# EasyEDA Pro project A类功放.eprj

# Schematic Schematic1
Board Name: Board1; Create Date: 2025-03-25; Page Name: P1; Project Name: A类功放; Schematic Name: Schematic1; Update Date: 2025-03-25; Company: 嘉立创EDA; Page Size: A4; Version: V1.0
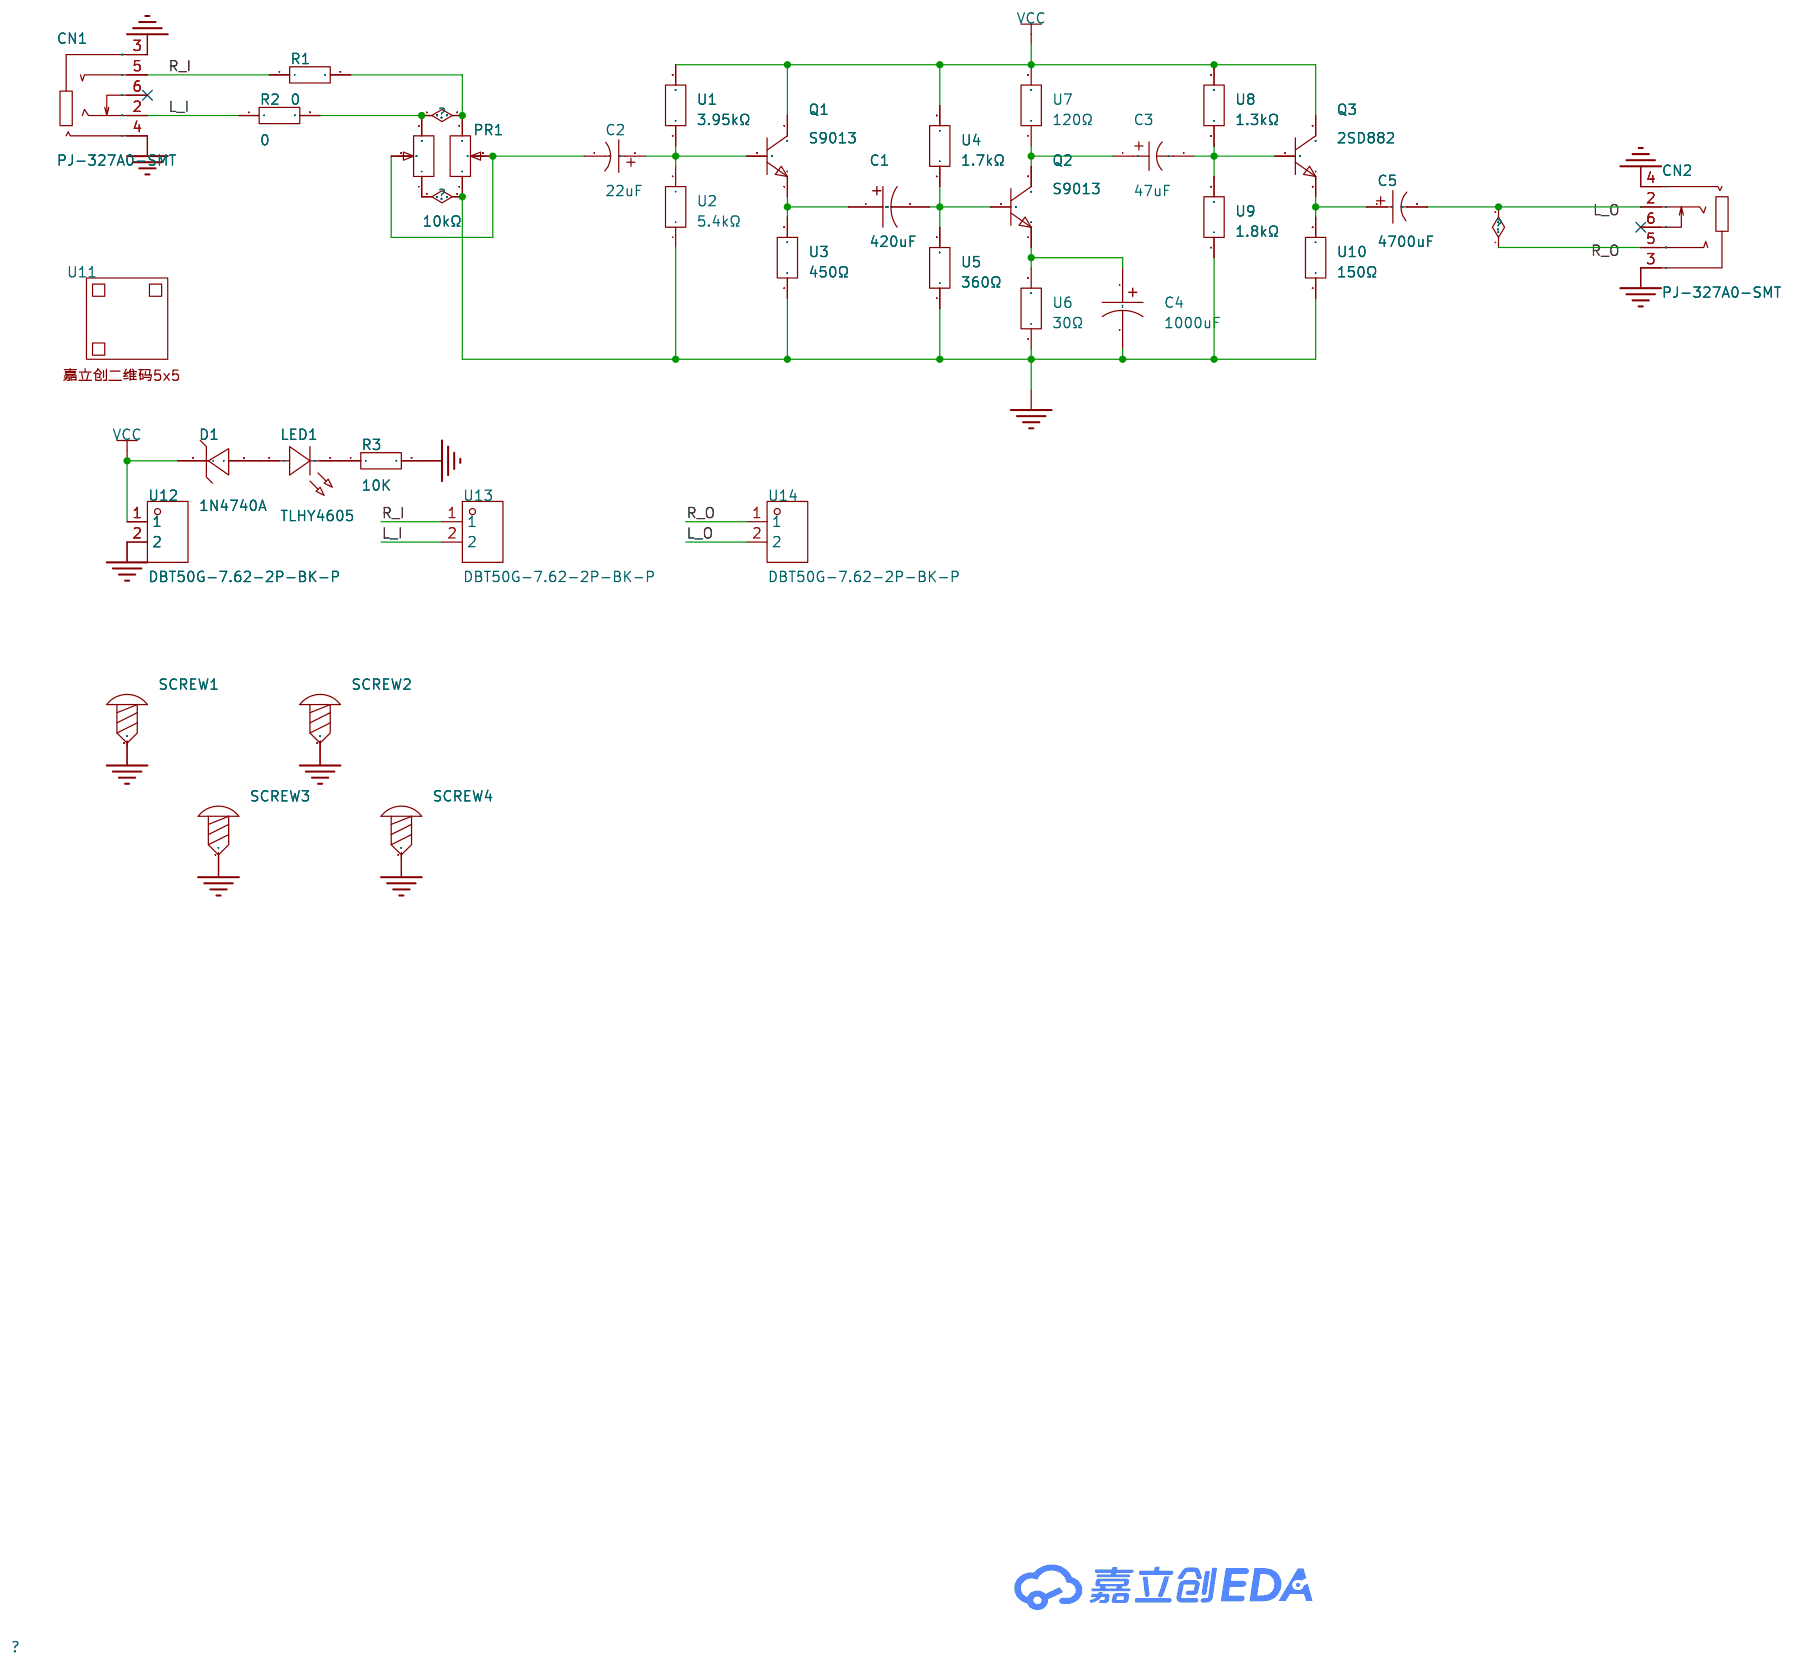
[diagram p0: schematic sheet]

## Parts
C1  420uF  [CAP-TH_BD8.0-P3.50-D0.6-FD]
C2  22uF  [CAP-TH_BD5.0-P2.00-D0.8-FD]
C3  47uF  [CAP-TH_BD5.0-P2.00-D0.8-FD]
C4  1000uF  [CAP-TH_BD10.0-P5.00-D1.0-FD]
C5  4700uF  [CAP-TH_BD16.0-P7.50-D1.2-FD]
CN1  PJ-327A0-SMT  [AUDIO-SMD_PJ-327A0-SMT]
CN2  PJ-327A0-SMT  [AUDIO-SMD_PJ-327A0-SMT]
D1  1N4740A  [DO-41_BD2.4-L4.7-P8.70-D0.9-RD]
LED1  TLHY4605  [LED-TH_BD3.2-P2.54-RD]
PR1  10kΩ  [RES-ADJ-TH_RK16312A0BKR]
Q1  S9013  [TO-92-3_L4.5-W3.5-P1.27-L]
Q2  S9013  [TO-92-3_L4.5-W3.5-P1.27-L]
Q3  2SD882  [TO-126_L8.3-W3.5-P2.29-T]
R1  0  [R0805]
R2  0  [R0805]
R3  10K  [R0805]
SCREW1  -  [M3螺丝]
SCREW2  -  [M3螺丝]
SCREW3  -  [M3螺丝]
SCREW4  -  [M3螺丝]
U1  3.95kΩ  [RES-TH_BD2.7-L6.2-P10.20-D0.4]
U2  5.4kΩ  [RES-TH_BD2.7-L6.2-P10.20-D0.4]
U3  450Ω  [RES-TH_BD2.7-L6.2-P10.20-D0.4]
U4  1.7kΩ  [RES-TH_BD2.7-L6.2-P10.20-D0.4]
U5  360Ω  [RES-TH_BD2.7-L6.2-P10.20-D0.4]
U6  30Ω  [RES-TH_BD2.7-L6.2-P10.20-D0.4]
U7  120Ω  [RES-TH_BD2.7-L6.2-P10.20-D0.4]
U8  1.3kΩ  [RES-TH_BD2.7-L6.2-P10.20-D0.4]
U9  1.8kΩ  [RES-TH_BD2.7-L6.2-P10.20-D0.4]
U10  150Ω  [RES-TH_BD2.7-L6.2-P10.20-D0.4]
U11  -  [JLC-QRCODE-5x5]
U12  DBT50G-7.62-2P-BK-P  [CONN-TH_2P-P7.62_L15.2-W16.7-EX4.2]
U13  DBT50G-7.62-2P-BK-P  [CONN-TH_2P-P7.62_L15.2-W16.7-EX4.2]
U14  DBT50G-7.62-2P-BK-P  [CONN-TH_2P-P7.62_L15.2-W16.7-EX4.2]

## Library data of the parts
C1 = 10YXG420MEFCTA8X7.5: LCSC Part Name: 420uF ±20% 10V; Supplier Part: C1592947; Manufacturer: rubycon(红宝石); Supplier Footprint: 插件,D8xL7.5mm; JLCPCB Part Class: Extended Part; Datasheet: https://atta.szlcsc.com/upload/public/pdf/source/20220328/A59CDC04CA3C2D674CA1281D38C243D4.pdf; Supplier: LCSC; Tolerance: ±20%; Rated Voltage: 10V; φD: 8mm; L: 7.5mm; Operating Temperature: -40℃~+105℃
C2 = EWH1HM220D11OT: LCSC Part Name: 22uF ±20% 50V; Supplier Part: C105323; Manufacturer: AISHI(艾华集团); Supplier Footprint: 插件,D5xL11mm; JLCPCB Part Class: Extended Part; Datasheet: https://atta.szlcsc.com/upload/public/pdf/source/20200106/C481308_16D735F9103482ADD8491C667D201AFA.pdf; Supplier: LCSC; Tolerance: ±20%; Voltage Rating: 50V; Ripple Current: 65mA@120Hz; Pin Spacing: 2mm; Diameter: 5mm; Height - Seated (Max): 11mm; Lifetime: 2000hrs@105℃
C3 = ERS1EM470D11OT: LCSC Part Name: 47uF ±20% 25V; Supplier Part: C106650; Manufacturer: AISHI(艾华集团); Supplier Footprint: 插件,D5xL11mm; JLCPCB Part Class: Extended Part; Datasheet: https://atta.szlcsc.com/upload/public/pdf/source/20191015/C438940_4B8E60A742BB0AE40DDEF87A5C89089D.pdf; Supplier: LCSC; Tolerance: ±20%; Voltage Rating: 25V; Pin Spacing: 2mm; Diameter: 5mm; Height - Seated (Max): 11mm; Lifetime: 5000hrs@105℃
C4 = 01EC4294SHC1000UF25V: LCSC Part Name: 1000uF ±20% 25V; Supplier Part: C503217; Manufacturer: KNSCHA(科尼盛); Supplier Footprint: 插件,D10xL16mm; JLCPCB Part Class: Extended Part; Datasheet: https://atta.szlcsc.com/upload/public/pdf/source/20240806/1082112373C74E03ED6704D18D61A53D.pdf; Supplier: LCSC; Tolerance: ±20%; Rated Voltage: 25V; Ripple Current: 450mA@120Hz; Lead Spacing: 5mm; φD: 10mm; L: 16mm; Lifetime @ Temp: 5000hrs@105℃
C5 = KM478M025K25RR0VH2FP0: LCSC Part Name: 4700uF ±20% 25V; Supplier Part: C45070; Manufacturer: CX(承兴); Supplier Footprint: 插件,D16xL25mm; JLCPCB Part Class: Extended Part; Datasheet: https://atta.szlcsc.com/upload/public/pdf/source/20211027/06D6BA3719C264B639DC286D935D03EA.pdf; Supplier: LCSC; Tolerance: ±20%; Rated Voltage: 25V; Lead Spacing: 7.5mm; φD: 16mm; L: 25mm; Lifetime @ Temp: 2000hrs@105℃
CN1 CN2 = PJ-327A0-SMT: 连接器类型:3.5mm耳机座;额定电流:500mA;额定电压:30V;工作温度范围:-20℃~+70℃;焊接温度(最大值):235℃;; LCSC Part Name: 3.5mm耳机座; Supplier Part: C381135; Manufacturer: XKB Connectivity(中国星坤); Supplier Footprint: SMD; JLCPCB Part Class: 扩展库; Datasheet: https://atta.szlcsc.com/upload/public/pdf/source/20211011/16B83D74DCFBFB52BBA1016D248FDA16.pdf; Supplier: LCSC; Connector Type: 3.5mm耳机座; Current Rating (Max): 500mA; Voltage Rating (Max): 30V; Operating Temperature Range: -20℃~+70℃; Soldering Temperature(Max): 235℃
D1 = 1N4740A_C238926: Supplier Part: C238926; Manufacturer: onsemi(安森美); Supplier Footprint: 插件,D2.03xL4.06mm; JLCPCB Part Class: Extended Part; Datasheet: https://atta.szlcsc.com/upload/public/pdf/source/20181009/C258175_DA035AFC58BF64FEA7E7C840A4D35D50.pdf; Supplier: LCSC; Diode Configuration: 独立式; Zener Voltage (Nom): 10V; Reverse Leakage Current (Ir): 10uA@7.6V; Zener Voltage (Range): 9.5V~10.5V; Power Dissipation: 1W; Zener Impedance (Zzt): 7Ω; Tolerance: ±5%
LED1 = TLHY4605: Supplier Part: C5960857; Manufacturer: VISHAY(威世); Supplier Footprint: 插件; JLCPCB Part Class: Extended Part; Datasheet: https://atta.szlcsc.com/upload/public/pdf/source/20230606/BB01526525C990542ED51A367FB43B85.pdf; Supplier: LCSC; Illumination Color: 黄色; Voltage - Forward(Vf): 2.4V; Forward Current: 10mA; Wavelength - Dominant: 588nm; Peak Wavelength: 585nm; Luminous Intensity: 5mcd; Viewing Angle: 120°
PR1 = RK16312101A2: LCSC Part Name: 10kΩ ±20% 三件套; Supplier Part: C470593; Manufacturer: ALPSALPINE(阿尔卑斯阿尔派); Supplier Footprint: 插件-6P; JLCPCB Part Class: Extended Part; Datasheet: https://atta.szlcsc.com/upload/public/pdf/source/20191216/C470593_7E935C2EB9A734DEAF0A292D32EDD773.pdf; Supplier: LCSC; Tolerance: ±20%; Turns: 1
Q1 Q2 = S9013_C2931497: Supplier Part: C2931497; Manufacturer: JSMSEMI(杰盛微); Supplier Footprint: TO-92-3; JLCPCB Part Class: Extended Part; Datasheet: https://atta.szlcsc.com/upload/public/pdf/source/20240105/5BA87CBB10CD2800A606235A557ECDD5.pdf; Supplier: LCSC; type: NPN; Current - Collector(Ic): 500mA; Collector - Emitter Voltage VCEO: 25V; Pd - Power Dissipation: 625mW; DC Current Gain: 144@50mA,1V; Transition frequency(fT): 150MHz; Current - Collector Cutoff: 100nA; Vce Saturation(VCE(sat)): 600mV
Q3 = 2SD882_C90797: LCSC Part Name: NPN 电流:3A 耐压:30V; Supplier Part: C90797; Manufacturer: ST(意法半导体); Supplier Footprint: TO-126; JLCPCB Part Class: Extended Part; Datasheet: https://atta.szlcsc.com/upload/public/pdf/source/20161226/1482720159312.pdf; Supplier: LCSC; Transistor Type: NPN; Collector Current (Ic): 3A; Collector-Emitter Breakdown Voltage (Vceo): 30V; Power Dissipation (Pd): 12.5W; DC Current Gain (hFE@Ic,Vce): 100@1A,2V; Transition Frequency (fT): 100MHz; Collector Cut-Off Current (Icbo): 100uA; Collector-Emitter Saturation Voltage (VCE(sat)@Ic,Ib): 400mV@1A,50mA; Operating Temperature: -65℃~+150℃
R1-R3 = Res_0805: Supplier Footprint: 0805
SCREW1-SCREW4 = M3螺丝: Supplier Footprint: 插件
U1-U10 = MF1/4W-3Ω9±1%-ST52: LCSC Part Name: 金属膜电阻 3.9Ω ±1% 250mW; Supplier Part: C2848601; Manufacturer: VO(翔胜); Supplier Footprint: 插件,D2.7xL6.2mm; JLCPCB Part Class: Extended Part; Datasheet: https://atta.szlcsc.com/upload/public/pdf/source/20200609/C601728_5AA4C0C8E12E11069DA2C3356F29D1F2.pdf; Supplier: LCSC; Type: 金属膜电阻; Tolerance: ±1%; Overload Voltage (Max): 250V; Power(Watts): 250mW; Temperature Coefficient: ±400ppm/℃; Operating Temperature Range: -55℃~+155℃
U11 = 嘉立创二维码5x5
U12-U14 = DBT50G-7.62-2P-BK-P: LCSC Part Name: 7.62mm 1x2P 每排P数:2 排数:1 直针 边脚; Supplier Part: C496127; Manufacturer: DORABO(地博电气); Supplier Footprint: 插件,P=7.62mm; JLCPCB Part Class: Extended Part; Datasheet: https://atta.szlcsc.com/upload/public/pdf/source/20230321/5EF6A0D07A73B1490602C5D26A4C0507.pdf; Supplier: LCSC; Barrier Type: 带盖板; Pitch: 7.62mm; Structure: 1x2P; Mounting Style: 直针; Pin Location: 边脚; Number of Pins: 2P; Number of Rows: 1; Current Rating (Max): 20A; Voltage Rating (Max): 300V; Wire Gauge - AWG: 12~22; Operating Temperature Range: -40℃~+105℃; Color: 黑色; Number of PINs Per Row: 2

## Nets
GND: C4.2 CN1.3 CN1.4 CN2.3 CN2.4 PR1.1 PR1.4 R3.2 SCREW1.1 SCREW2.1 SCREW3.1 SCREW4.1 U2.1 U3.1 U5.1 U6.1 U9.1 U10.1 U12.2
VCC: D1.1(K) Q1.3(C) Q3.2(C) U1.2 U4.2 U7.2 U8.2 U12.1
L_I: CN1.2 R2.1 U13.2
L_O: C5.2 CN2.2 CN2.5 U14.1 U14.2
R_I: CN1.5 R1.1 U13.1
$1N174: C2.1 Q1.2(B) U1.1 U2.2
$1N304: C1.1 Q1.1(E) U3.2
$1N442: C1.2 Q2.2(B) U4.1 U5.2
$1N655: C3.1 Q2.3(C) U7.1
$1N660: C4.1 Q2.1(E) U6.2
$1N1030: C3.2 Q3.1(B) U8.1 U9.2
$1N1165: C5.1 Q3.3(E) U10.2
$1N2103: C2.2 PR1.2 PR1.5
$1N2212: PR1.3 PR1.6 R1.2 R2.2
$1N3020: D1.2(A) LED1.2(A)
$1N3022: LED1.1(C) R3.1

Not connected (* = marked no-connect by the designer): CN1 6*; CN2 6*

# Board PCB1
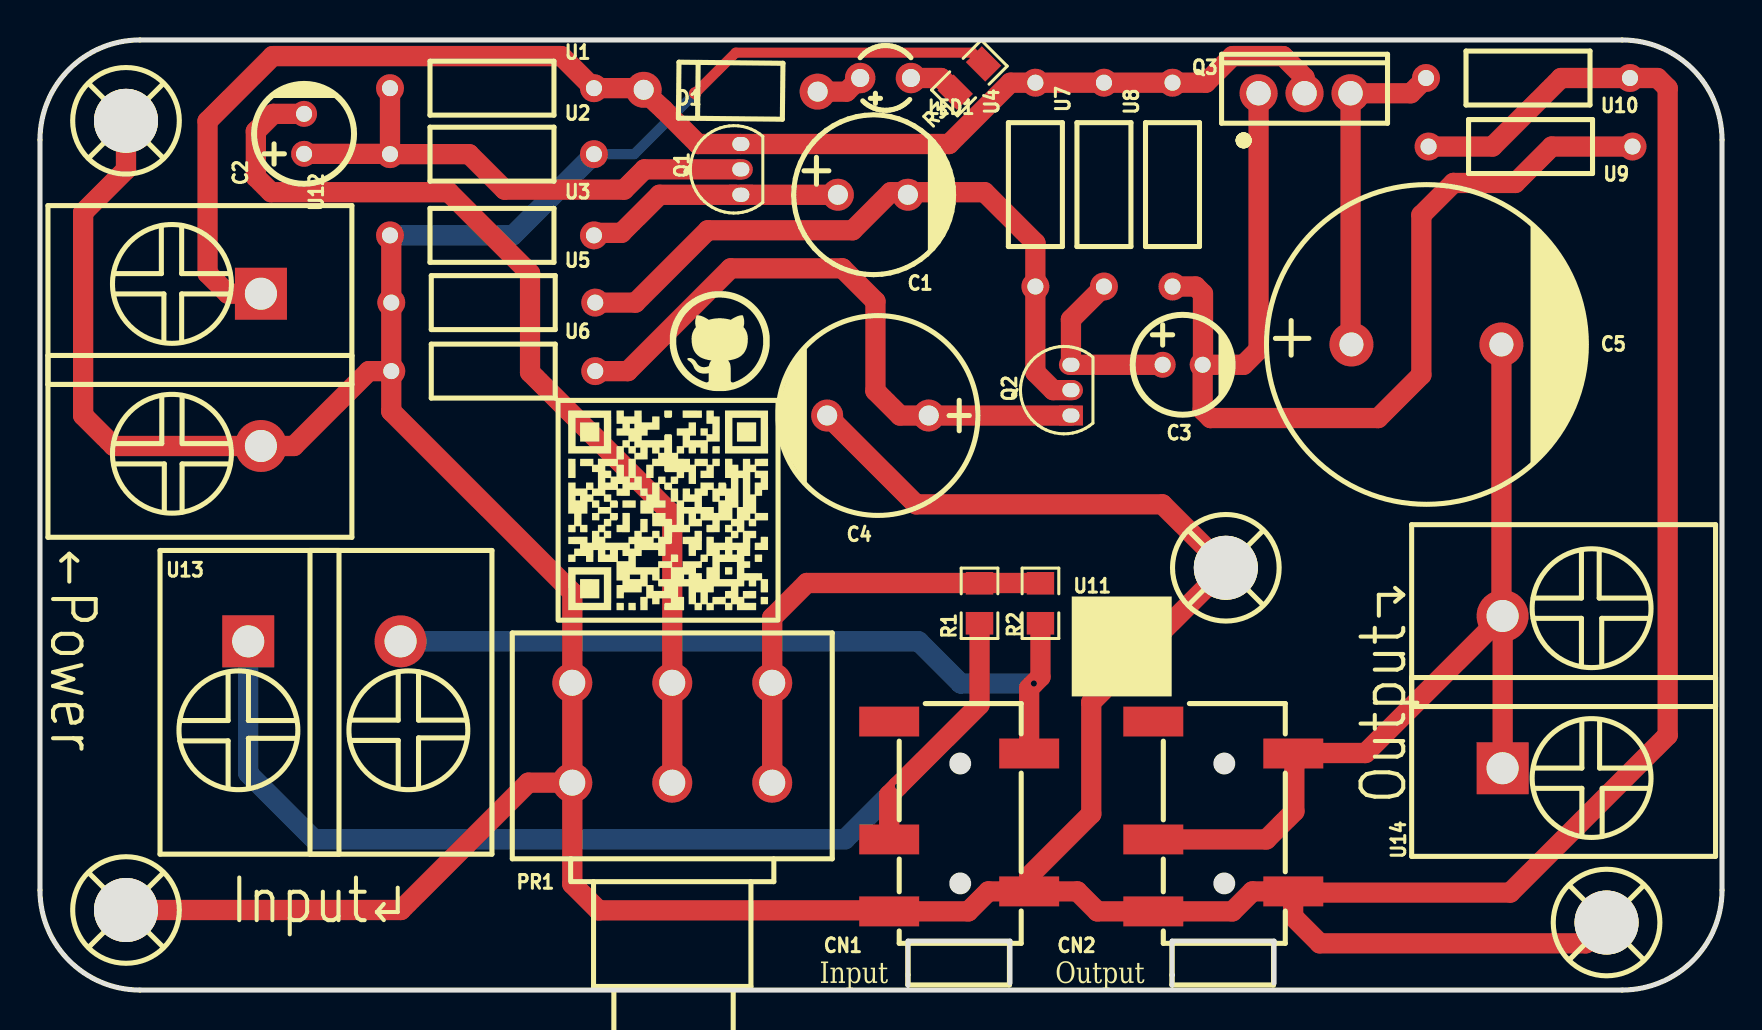
[diagram p1: board, top side]
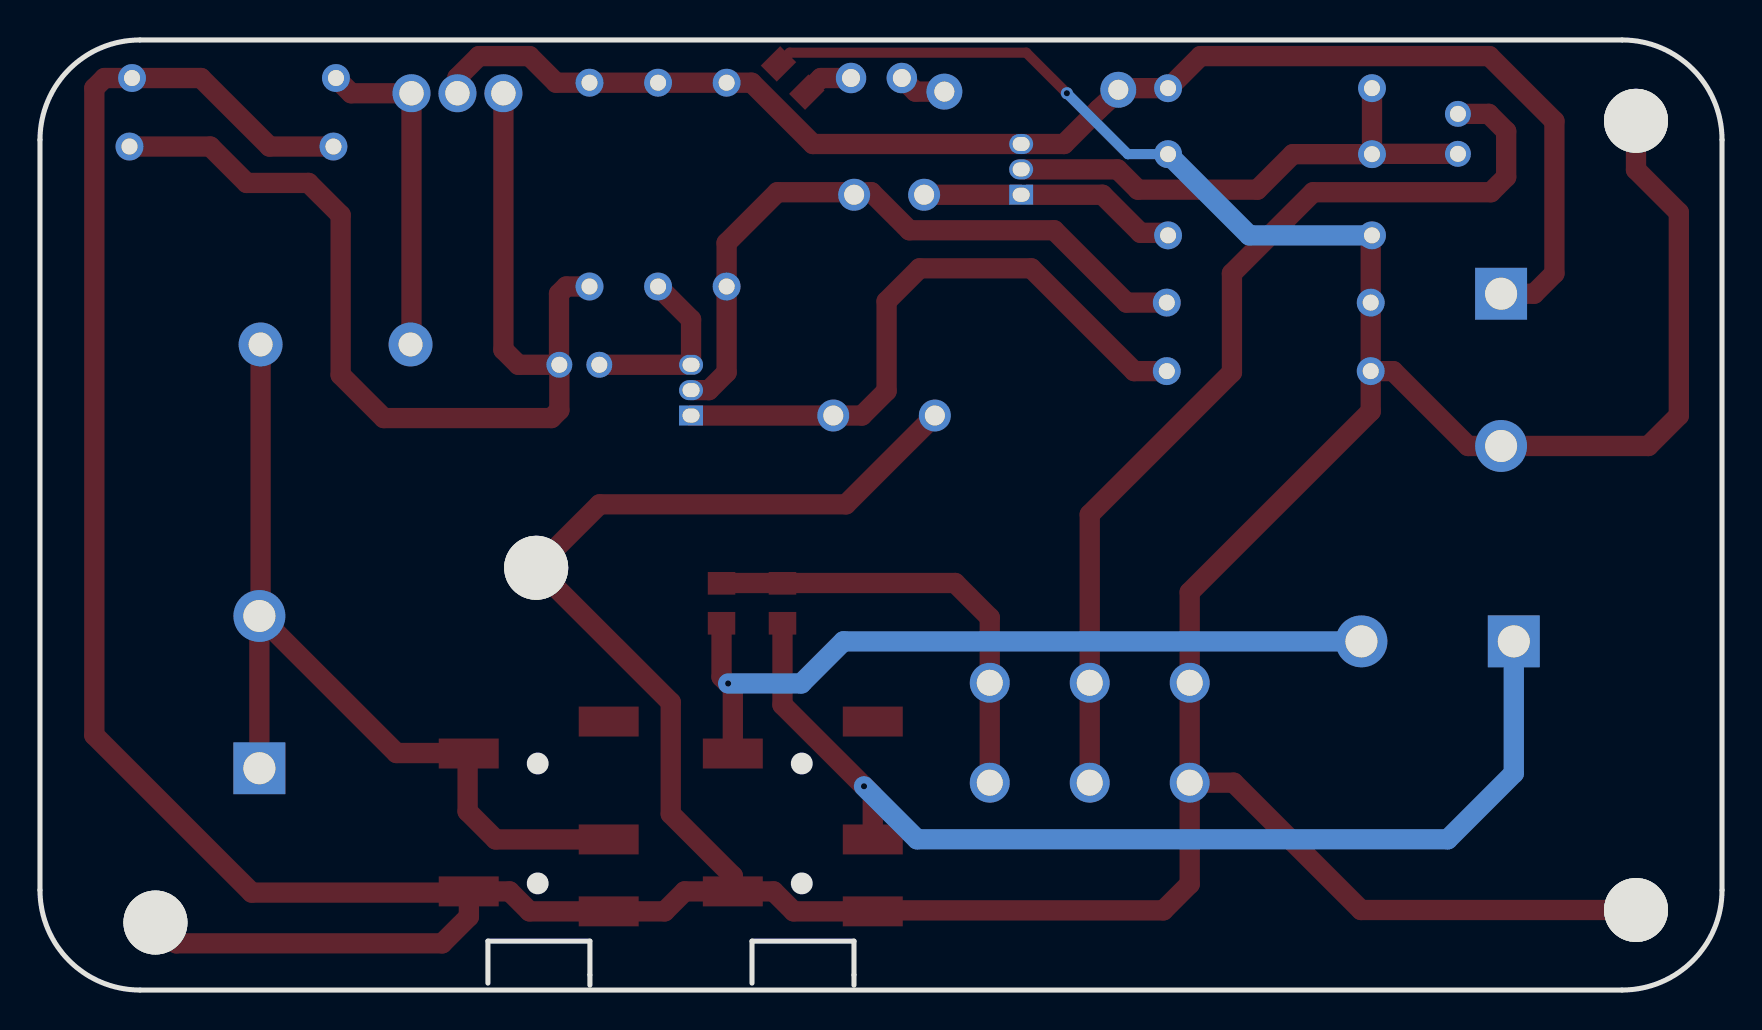
[diagram p2: board, bottom side, seen from below]

Outline 84.12 x 47.55 mm; copper layers: Top Layer, Bottom Layer. Coordinates in mm from the lower left corner of the outline.
Outline path: 0,42.55 0,5 arc(1.46,1.46) 5,0 79.12,0 arc(82.66,1.46) 84.12,5 84.12,42.55 arc(82.66,46.08) 79.12,47.55 5,47.55 arc(1.46,46.08) 0,42.55
Stack: Top Layer 0.035mm / Dielectric1 1.51mm FR4 er 4.5 / Bottom Layer 0.035mm

## Design rules (mm)
template: JLCPCB Capability(Two Layers Board)
spacing copperThickness1oz (default): track to track 0.102, other pairs 0.152 to 0.3
spacing copperThickness2oz: track to track 0.203, other pairs 0.152 to 0.3
track width copperThickness1oz (default): min 0.127, default 0.254, max 2.54
track width copperThickness2oz: min 0.203, default 0.254, max 2.54
differential pair differentialPair (default): width min 0.127, default 0.254, max 2.54; gap min 0.152, default 0.152
via viaSize (default): diameter min 0.5, default 0.61, max 10; hole min 0.3, default 0.305, max 6.3

## Placement (name value [footprint] x y rotation side)
C1  420uF  [CAP-TH_BD8.0-P3.50-D0.6-FD]  41.66 39.8 0 top
C2  22uF  [CAP-TH_BD5.0-P2.00-D0.8-FD]  13.21 42.85 90 top
C3  47uF  [CAP-TH_BD5.0-P2.00-D0.8-FD]  57.15 31.29 0 top
C4  1000uF  [CAP-TH_BD10.0-P5.00-D1.0-FD]  41.91 28.75 180 top
C5  4700uF  [CAP-TH_BD16.0-P7.50-D1.2-FD]  69.34 32.31 0 top
CN1  PJ-327A0-SMT  [AUDIO-SMD_PJ-327A0-SMT]  45.97 8.69 90 top
CN2  PJ-327A0-SMT  [AUDIO-SMD_PJ-327A0-SMT]  59.18 8.69 90 top
D1  1N4740A  [DO-41_BD2.4-L4.7-P8.70-D0.9-RD]  34.54 45.01 359.4 top
LED1  TLHY4605  [LED-TH_BD3.2-P2.54-RD]  42.29 45.64 180 top
PR1  10kΩ  [RES-ADJ-TH_RK16312A0BKR]  31.62 12.88 270 top
Q1  S9013  [TO-92-3_L4.5-W3.5-P1.27-L]  35.05 41.07 90 top
Q2  S9013  [TO-92-3_L4.5-W3.5-P1.27-L]  51.56 30.02 90 top
Q3  2SD882  [TO-126_L8.3-W3.5-P2.29-T]  63.25 44.88 90 top
R1  0  [R0805]  46.99 19.36 90 top
R2  0  [R0805]  50.04 19.36 90 top
R3  10K  [R0805]  46.48 45.64 45 top
SCREW1  -  [M3螺丝]  4.3 4.01 0 top
SCREW2  -  [M3螺丝]  4.3 43.5 0 top
SCREW3  -  [M3螺丝]  78.35 3.38 0 top
SCREW4  -  [M3螺丝]  59.31 21.13 0 top
U1  3.95kΩ  [RES-TH_BD2.7-L6.2-P10.20-D0.4]  22.61 45.14 0 top
U2  5.4kΩ  [RES-TH_BD2.7-L6.2-P10.20-D0.4]  22.61 41.83 180 top
U3  450Ω  [RES-TH_BD2.7-L6.2-P10.20-D0.4]  22.61 37.77 0 top
U4  1.7kΩ  [RES-TH_BD2.7-L6.2-P10.20-D0.4]  49.78 40.31 90 top
U5  360Ω  [RES-TH_BD2.7-L6.2-P10.20-D0.4]  22.67 34.4 0 top
U6  30Ω  [RES-TH_BD2.7-L6.2-P10.20-D0.4]  22.67 30.98 0 top
U7  120Ω  [RES-TH_BD2.7-L6.2-P10.20-D0.4]  53.21 40.31 90 top
U8  1.3kΩ  [RES-TH_BD2.7-L6.2-P10.20-D0.4]  56.64 40.31 90 top
U9  1.8kΩ  [RES-TH_BD2.7-L6.2-P10.20-D0.4]  74.55 42.22 0 top
U10  150Ω  [RES-TH_BD2.7-L6.2-P10.20-D0.4]  74.42 45.64 180 top
U11  -  [JLC-QRCODE-5x5]  54.1 17.2 0 top
U12  DBT50G-7.62-2P-BK-P  [CONN-TH_2P-P7.62_L15.2-W16.7-EX4.2]  11.05 31.04 270 top
U13  DBT50G-7.62-2P-BK-P  [CONN-TH_2P-P7.62_L15.2-W16.7-EX4.2]  14.22 17.45 0 top
U14  DBT50G-7.62-2P-BK-P  [CONN-TH_2P-P7.62_L15.2-W16.7-EX4.2]  73.15 14.91 90 top

## Footprints (pads in the part's own frame, mm; a bottom-side part is the same pattern mirrored in y, then rotated)
AUDIO-SMD_PJ-327A0-SMT
  rect 1.5x3 smd: 2(3.15,-3.5) 3(-3.75,-3.5) 4(-4.75,3.5) 5(-1.15,3.5) 6(4.75,3.5)
CAP-TH_BD5.0-P2.00-D0.8-FD
  round 1.3 hole 0.8: 1(-1,0) 2(1,0)
CAP-TH_BD8.0-P3.50-D0.6-FD
  round 1.6 hole 1: 1(-1.75,0) 2(1.75,0)
CAP-TH_BD10.0-P5.00-D1.0-FD
  round 1.6 hole 1: 1(-2.54,0) 2(2.54,0)
CAP-TH_BD16.0-P7.50-D1.2-FD
  round 2.2 hole 1.2: 1(-3.75,0) 2(3.75,0)
CONN-TH_2P-P7.62_L15.2-W16.7-EX4.2
  rect 2.6x2.6 hole 1.6: 1(-3.81,0)
  round 2.6 hole 1.6: 2(3.81,0)
DO-41_BD2.4-L4.7-P8.70-D0.9-RD
  round 1.8 hole 1: 1(-4.35,0) 2(4.35,0)
LED-TH_BD3.2-P2.54-RD
  round 1.524 hole 0.9: 1(-1.27,0) 2(1.27,0)
M3螺丝
  round 3.2 hole 3.2: 1(0,0)
R0805
  rect 1.133x1.377 smd: 1(-1,0) 2(1,0)
RES-ADJ-TH_RK16312A0BKR
  round 2 hole 1.3: 1(2.5,-5) 2(2.5,0) 3(2.5,5) 4(-2.5,-5) 5(-2.5,0) 6(-2.5,5)
RES-TH_BD2.7-L6.2-P10.20-D0.4
  round 1.4 hole 0.8: 1(-5.1,0) 2(5.1,0)
TO-92-3_L4.5-W3.5-P1.27-L
  rect 1x1.2 hole 0.7x0.85: 1(-1.27,0)
  oval 1x1.2 hole 0.7x0.85: 2(0,0) 3(1.27,0)
TO-126_L8.3-W3.5-P2.29-T
  round 1.905 hole 1.219: 1(0,2.299) 2(0,0) 3(0,-2.299)

## Nets
As in the schematic.

Pads without a net: CN1 6; CN2 6

## Via types
v1: diameter 0.61, hole 0.305, Top Layer to Bottom Layer, 3 vias

## Routing (per net, layer and track width the routed paths; a pad name or vN(x,y) marks a point on that pad's centre or on a via; arc(x,y) is an arc through that point)
GND: length 294.8
  Top Layer w0.508: v1(32.77,44.88) 34.8,46.91 46.63,46.91 47.19,46.35
  Top Layer w1.016: U3.1 17.57,37.71 U5.1 U6.1 ; 62.67,4.5 62.67,3.67 64.01,2.34 77.31,2.34 SCREW3.1 ; C4.2 43.81,24.31 56.13,24.31 SCREW4.1 52.58,14.4 52.58,8.81 49.47,5.71 CN1.3 ; CN1.3 51.88,4.94 52.88,3.94 CN2.4 59.64,3.94 60.64,4.94 CN2.3 62.74,4.88 73.53,4.88 81.41,12.75 81.41,45.14 80.9,45.64 U10.1 76.07,45.64 72.64,42.22 U9.1 ; CN1.3 47.43,4.94 46.43,3.94 CN1.4 42.42,3.99 27.94,3.99 26.62,5.31 PR1.1 ; PR1.1 PR1.4 26.62,19.91 17.57,28.96 U6.1 ; PR1.1 24.42,10.38 18.05,4.01 SCREW1.1 ; U6.1 16.45,30.98 12.7,27.23 U12.2 3.68,27.23 2.16,28.75 2.16,38.91 4.3,41.06 SCREW2.1
  Bottom Layer w0.508: v1(32.77,44.88) 29.72,41.83 U2.1
  Bottom Layer w1.016: U2.1 23.64,37.77 U3.1
VCC: length 72.4
  Top Layer w1.016: 27.73,45.09 26.08,46.74 11.64,46.74 8.38,43.49 8.38,35.87 9.4,34.85 U12.1 ; D1.1 30.11,45.14 30.02,45.14 ; 30.02,45.14 31.17,44.08 32.91,42.34 Q1.3 45.47,42.34 48.53,45.41 U4.2 U7.2 U8.2 58.31,45.41 59.64,46.74 62.17,46.74 63.25,45.66 63.25,44.5 ; 30.02,45.14 U1.2
L_I: length 39.3
  Top Layer w1.016: CN1.2 49.47,15.11 v1(49.71,15.34) 50.04,15.67 R2.1
  Bottom Layer w1.016: U13.2 43.94,17.45 46.05,15.34 v1(49.71,15.34)
L_O: length 44.6
  Top Layer w1.016: CN2.5 61.33,7.54 62.74,8.94 62.74,11.78 CN2.2 ; U14.1 U14.2 ; 63.12,11.86 66.29,11.86 73.09,18.66 C5.2
R_I: length 54.3
  Top Layer w1.016: R1.1 46.99,14.28 v1(42.91,10.2) 42.47,9.76 CN1.5
  Bottom Layer w1.016: v1(42.91,10.2) 40.26,7.54 13.72,7.54 10.41,10.85 U13.1
$1N174: length 26.3
  Top Layer w1.016: 17.49,41.85 C2.1 ; 17.49,41.85 U2.2 21.46,41.83 23.24,40.06 29.21,40.06 30.23,41.07 Q1.2 ; 17.49,41.85 17.51,41.87 U1.1
$1N304: length 12.8
  Top Layer w1.016: 34.8,39.8 30.99,39.8 29.08,37.9 27.83,37.9 U3.2 ; Q1.1 C1.1
$1N442: length 34
  Top Layer w1.016: Q2.2 50.67,30.02 49.78,30.91 U4.1 49.78,37.39 47.24,39.93 42.55,39.93 40.64,38.02 33.4,38.02 29.78,34.4 U5.2
$1N655: length 9.2
  Top Layer w1.016: C3.1 Q2.3 51.56,33.56 U7.1
$1N660: length 31.6
  Top Layer w1.016: U6.2 29.4,30.98 34.54,36.12 40.13,36.12 41.78,34.47 41.78,29.98 43.01,28.75 C4.1 Q2.1
$1N1030: length 55.4
  Top Layer w1.016: U9.2 75.61,42.22 73.79,40.39 70.7,40.39 69.09,38.79 69.09,30.79 66.93,28.63 58.55,28.63 58.15,29.02 C3.2 ; C3.2 60.2,31.29 60.95,32.04 Q3.1 ; C3.2 58.17,31.31 58.17,34.85 57.81,35.21 U8.1
$1N1165: length 16.3
  Top Layer w1.016: U10.2 68.56,44.88 Q3.3 ; 65.54,44.45 65.54,32.36 C5.1
$1N2103: length 49.2
  Top Layer w1.016: C2.2 11.67,43.85 10.8,42.98 10.8,40.69 11.56,39.93 20.45,39.93 24.51,35.87 24.51,30.91 31.62,23.8 PR1.5 PR1.2
$1N2212: length 22.4
  Top Layer w1.016: PR1.3 PR1.6 36.62,18.64 38.35,20.37 50.02,20.37 R2.2
$1N3020: length 2.4
  Top Layer w1.016: D1.2 40.34,44.96 LED1.2
$1N3022: length 2.5
  Top Layer w1.016: LED1.1 45.07,45.64 45.78,44.94

## Text on the board
Top Silkscreen Layer: Input | Output | Input↵ | Output↴ | ←Power
